# EAGLE schematic e4 (EAGLE 6.1)
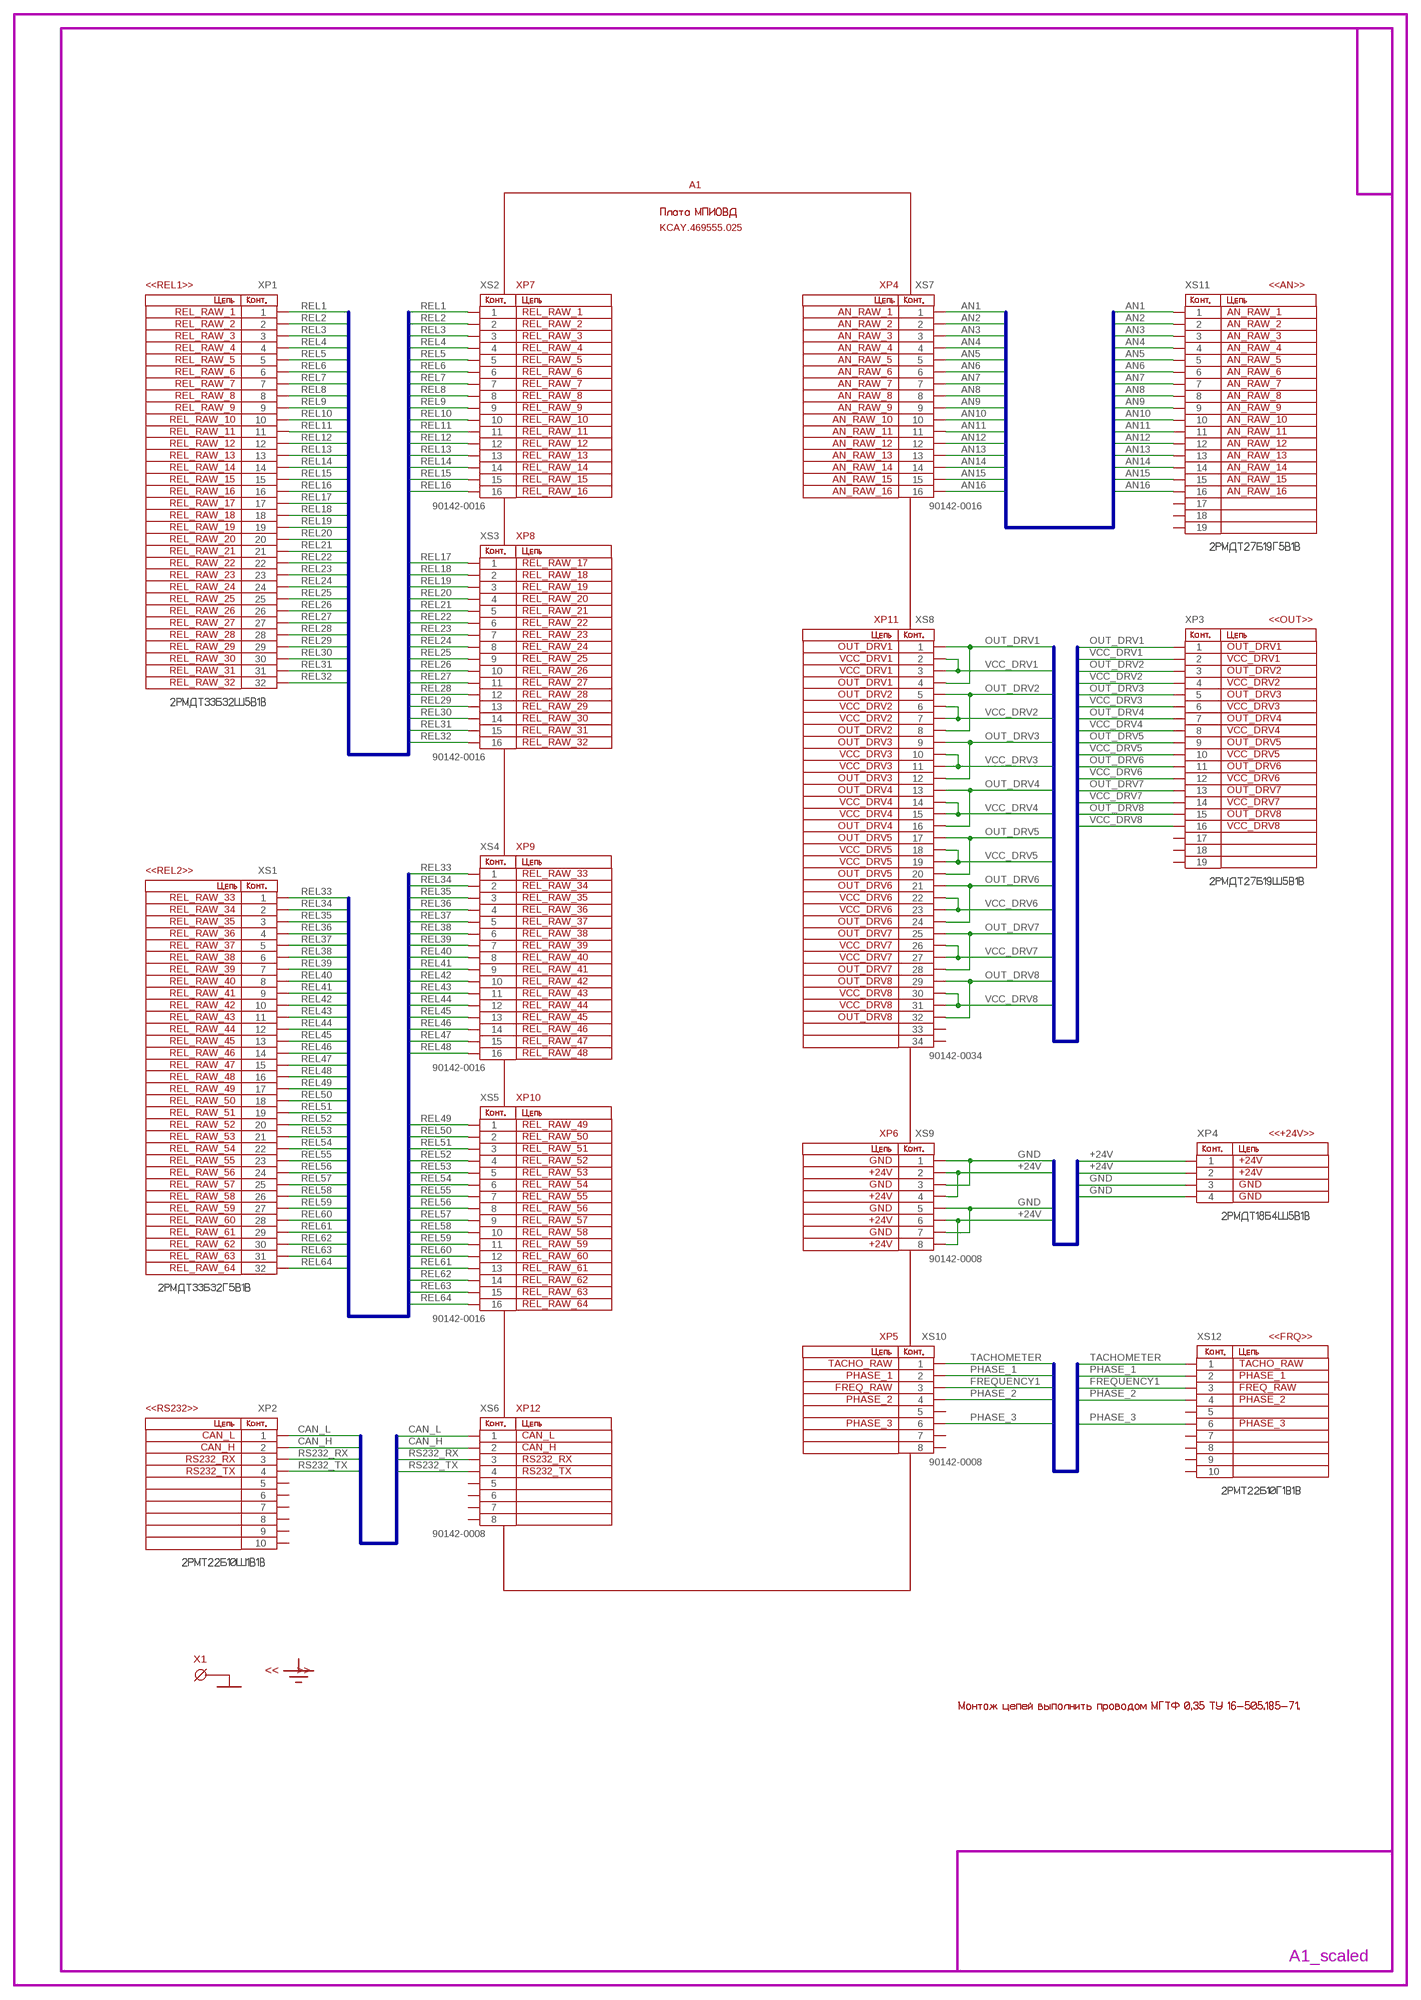
[diagram p0: schematic, sheet 1]

## Parts
XP1  GENERIC_32_XP  [FAKE]
XP2  GENERIC_10_XP  [FAKE]
XP3  GENERIC_19_XP  [FAKE]
XP4  GENERIC_04_XP  [FAKE]
XS1  GENERIC_32_XS  [FAKE]
XS2  90142-0016  GENERIC_16_XS  [FAKE]
XS3  90142-0016  GENERIC_16_XS  [FAKE]
XS4  90142-0016  GENERIC_16_XS  [FAKE]
XS5  90142-0016  GENERIC_16_XS  [FAKE]
XS6  90142-0008  GENERIC_08_XS  [FAKE]
XS7  90142-0016  GENERIC_16_XS  [FAKE]
XS8  90142-0034  GENERIC_34_XS  [FAKE]
XS9  90142-0008  GENERIC_08_XS  [FAKE]
XS10  90142-0008  GENERIC_08_XS  [FAKE]
XS11  GENERIC_19_XS  [FAKE]
XS12  GENERIC_10_XS  [FAKE]

## Nets
+24V: XP4.1 XP4.2 XS9.2 XS9.4 XS9.6 XS9.8
AN1: XS7.1 XS11.1
AN2: XS7.2 XS11.2
AN3: XS7.3 XS11.3
AN4: XS7.4 XS11.4
AN5: XS7.5 XS11.5
AN6: XS7.6 XS11.6
AN7: XS7.7 XS11.7
AN8: XS7.8 XS11.8
AN9: XS7.9 XS11.9
AN10: XS7.10 XS11.10
AN11: XS7.11 XS11.11
AN12: XS7.12 XS11.12
AN13: XS7.13 XS11.13
AN14: XS7.14 XS11.14
AN15: XS7.15 XS11.15
AN16: XS7.16 XS11.16
CAN_H: XP2.2 XS6.2
CAN_L: XP2.1 XS6.1
FREQUENCY1: XS10.3 XS12.3
GND: XP4.3 XP4.4 XS9.1 XS9.3 XS9.5 XS9.7
OUT_DRV1: XP3.1 XS8.1 XS8.4
OUT_DRV2: XP3.3 XS8.5 XS8.8
OUT_DRV3: XP3.5 XS8.9 XS8.12
OUT_DRV4: XP3.7 XS8.13 XS8.16
OUT_DRV5: XP3.9 XS8.17 XS8.20
OUT_DRV6: XP3.11 XS8.21 XS8.24
OUT_DRV7: XP3.13 XS8.25 XS8.28
OUT_DRV8: XP3.15 XS8.29 XS8.32
PHASE_1: XS10.2 XS12.2
PHASE_2: XS10.4 XS12.4
PHASE_3: XS10.6 XS12.6
REL1: XP1.1 XS2.1
REL2: XP1.2 XS2.2
REL3: XP1.3 XS2.3
REL4: XP1.4 XS2.4
REL5: XP1.5 XS2.5
REL6: XP1.6 XS2.6
REL7: XP1.7 XS2.7
REL8: XP1.8 XS2.8
REL9: XP1.9 XS2.9
REL10: XP1.10 XS2.10
REL11: XP1.11 XS2.11
REL12: XP1.12 XS2.12
REL13: XP1.13 XS2.13
REL14: XP1.14 XS2.14
REL15: XP1.15 XS2.15
REL16: XP1.16 XS2.16
REL17: XP1.17 XS3.1
REL18: XP1.18 XS3.2
REL19: XP1.19 XS3.3
REL20: XP1.20 XS3.4
REL21: XP1.21 XS3.5
REL22: XP1.22 XS3.6
REL23: XP1.23 XS3.7
REL24: XP1.24 XS3.8
REL25: XP1.25 XS3.9
REL26: XP1.26 XS3.10
REL27: XP1.27 XS3.11
REL28: XP1.28 XS3.12
REL29: XP1.29 XS3.13
REL30: XP1.30 XS3.14
REL31: XP1.31 XS3.15
REL32: XP1.32 XS3.16
REL33: XS1.1 XS4.1
REL34: XS1.2 XS4.2
REL35: XS1.3 XS4.3
REL36: XS1.4 XS4.4
REL37: XS1.5 XS4.5
REL38: XS1.6 XS4.6
REL39: XS1.7 XS4.7
REL40: XS1.8 XS4.8
REL41: XS1.9 XS4.9
REL42: XS1.10 XS4.10
REL43: XS1.11 XS4.11
REL44: XS1.12 XS4.12
REL45: XS1.13 XS4.13
REL46: XS1.14 XS4.14
REL47: XS1.15 XS4.15
REL48: XS1.16 XS4.16
REL49: XS1.17 XS5.1
REL50: XS1.18 XS5.2
REL51: XS1.19 XS5.3
REL52: XS1.20 XS5.4
REL53: XS1.21 XS5.5
REL54: XS1.22 XS5.6
REL55: XS1.23 XS5.7
REL56: XS1.24 XS5.8
REL57: XS1.25 XS5.9
REL58: XS1.26 XS5.10
REL59: XS1.27 XS5.11
REL60: XS1.28 XS5.12
REL61: XS1.29 XS5.13
REL62: XS1.30 XS5.14
REL63: XS1.31 XS5.15
REL64: XS1.32 XS5.16
RS232_RX: XP2.3 XS6.3
RS232_TX: XP2.4 XS6.4
TACHOMETER: XS10.1 XS12.1
VCC_DRV1: XP3.2 XS8.2 XS8.3
VCC_DRV2: XP3.4 XS8.6 XS8.7
VCC_DRV3: XP3.6 XS8.10 XS8.11
VCC_DRV4: XP3.8 XS8.14 XS8.15
VCC_DRV5: XP3.10 XS8.18 XS8.19
VCC_DRV6: XP3.12 XS8.22 XS8.23
VCC_DRV7: XP3.14 XS8.26 XS8.27
VCC_DRV8: XP3.16 XS8.30 XS8.31
Unconnected: XP2.5 XP2.6 XP2.7 XP2.8 XP2.9 XP2.10 XP3.17 XP3.18 XP3.19 XS6.5 XS6.6 XS6.7 XS6.8 XS8.33 XS8.34 XS10.5 XS10.7 XS10.8 XS11.17 XS11.18 XS11.19 XS12.5 XS12.7 XS12.8 XS12.9 XS12.10

## Buses
AN[1..16]
REL[1..64]
OUT_DRV[1..8],VCC_DRV[1..8]
+24,GND
PHASE1,PHASE2,PHASE3,TACHOMETER,FREQUENCY1
CAN_H,CAN_L,RS232_TX,RS232_RX

## Notes on the sheet
- A1
- KCAY.469555.025
- <<REL1>> | XP7 | XP4 | <<AN>>
- REL_RAW_1 | REL_RAW_1 | AN_RAW_1 | AN_RAW_1
- REL_RAW_2 | REL_RAW_2 | AN_RAW_2 | AN_RAW_2
- REL_RAW_3 | REL_RAW_3 | AN_RAW_3 | AN_RAW_3
- REL_RAW_4 | REL_RAW_4 | AN_RAW_4 | AN_RAW_4
- REL_RAW_5 | REL_RAW_5 | AN_RAW_5 | AN_RAW_5
- REL_RAW_6 | REL_RAW_6 | AN_RAW_6 | AN_RAW_6
- REL_RAW_7 | REL_RAW_7 | AN_RAW_7 | AN_RAW_7
- REL_RAW_8 | REL_RAW_8 | AN_RAW_8 | AN_RAW_8
- REL_RAW_9 | REL_RAW_9 | AN_RAW_9 | AN_RAW_9
- REL_RAW_10 | REL_RAW_10 | AN_RAW_10 | AN_RAW_10
- REL_RAW_11 | REL_RAW_11 | AN_RAW_11 | AN_RAW_11
- REL_RAW_12 | REL_RAW_12 | AN_RAW_12 | AN_RAW_12
- REL_RAW_13 | REL_RAW_13 | AN_RAW_13 | AN_RAW_13
- REL_RAW_14 | REL_RAW_14 | AN_RAW_14 | AN_RAW_14
- REL_RAW_15 | REL_RAW_15 | AN_RAW_15 | AN_RAW_15
- REL_RAW_16 | REL_RAW_16 | AN_RAW_16 | AN_RAW_16
- REL_RAW_17
- REL_RAW_18
- REL_RAW_19
- XP8
- REL_RAW_20
- REL_RAW_21
- REL_RAW_22 | REL_RAW_17
- REL_RAW_23 | REL_RAW_18
- REL_RAW_24 | REL_RAW_19
- REL_RAW_25 | REL_RAW_20
- REL_RAW_26 | REL_RAW_21
- XP11 | <<OUT>>
- REL_RAW_27 | REL_RAW_22
- REL_RAW_28 | REL_RAW_23
- REL_RAW_29 | REL_RAW_24 | OUT_DRV1 | OUT_DRV1
- REL_RAW_30 | REL_RAW_25 | VCC_DRV1 | VCC_DRV1
- REL_RAW_31 | REL_RAW_26 | VCC_DRV1 | OUT_DRV2
- REL_RAW_32 | REL_RAW_27 | OUT_DRV1 | VCC_DRV2
- REL_RAW_28 | OUT_DRV2 | OUT_DRV3
- REL_RAW_29 | VCC_DRV2 | VCC_DRV3
- REL_RAW_30 | VCC_DRV2 | OUT_DRV4
- REL_RAW_31 | OUT_DRV2 | VCC_DRV4
- REL_RAW_32 | OUT_DRV3 | OUT_DRV5
- VCC_DRV3 | VCC_DRV5
- VCC_DRV3 | OUT_DRV6
- OUT_DRV3 | VCC_DRV6
- OUT_DRV4 | OUT_DRV7
- VCC_DRV4 | VCC_DRV7
- VCC_DRV4 | OUT_DRV8
- OUT_DRV4 | VCC_DRV8
- OUT_DRV5
- XP9
- VCC_DRV5
- VCC_DRV5
- <<REL2>>
- REL_RAW_33 | OUT_DRV5
- REL_RAW_34 | OUT_DRV6
- REL_RAW_33 | REL_RAW_35 | VCC_DRV6
- REL_RAW_34 | REL_RAW_36 | VCC_DRV6
- REL_RAW_35 | REL_RAW_37 | OUT_DRV6
- REL_RAW_36 | REL_RAW_38 | OUT_DRV7
- REL_RAW_37 | REL_RAW_39 | VCC_DRV7
- REL_RAW_38 | REL_RAW_40 | VCC_DRV7
- REL_RAW_39 | REL_RAW_41 | OUT_DRV7
- REL_RAW_40 | REL_RAW_42 | OUT_DRV8
- REL_RAW_41 | REL_RAW_43 | VCC_DRV8
- REL_RAW_42 | REL_RAW_44 | VCC_DRV8
- REL_RAW_43 | REL_RAW_45 | OUT_DRV8
- REL_RAW_44 | REL_RAW_46
- REL_RAW_45 | REL_RAW_47
- REL_RAW_46 | REL_RAW_48
- REL_RAW_47
- REL_RAW_48
- REL_RAW_49
- XP10
- REL_RAW_50
- REL_RAW_51
- REL_RAW_52 | REL_RAW_49
- XP6 | <<+24V>>
- REL_RAW_53 | REL_RAW_50
- REL_RAW_54 | REL_RAW_51
- REL_RAW_55 | REL_RAW_52 | GND | +24V
- REL_RAW_56 | REL_RAW_53 | +24V | +24V
- REL_RAW_57 | REL_RAW_54 | GND | GND
- REL_RAW_58 | REL_RAW_55 | +24V | GND
- REL_RAW_59 | REL_RAW_56 | GND
- REL_RAW_60 | REL_RAW_57 | +24V
- REL_RAW_61 | REL_RAW_58 | GND
- REL_RAW_62 | REL_RAW_59 | +24V
- REL_RAW_63 | REL_RAW_60
- REL_RAW_64 | REL_RAW_61
- REL_RAW_62
- REL_RAW_63
- REL_RAW_64
- XP5 | <<FRQ>>
- TACHO_RAW | TACHO_RAW
- PHASE_1 | PHASE_1
- FREQ_RAW | FREQ_RAW
- PHASE_2 | PHASE_2
- <<RS232>> | XP12
- PHASE_3 | PHASE_3
- CAN_L | CAN_L
- CAN_H | CAN_H
- RS232_RX | RS232_RX
- RS232_TX | RS232_TX
- X1
- <<     >>

## Library data of the parts
XP1 = connector:GENERIC_32_XP
XP2 = connector:GENERIC_10_XP
XP3 = connector:GENERIC_19_XP
XP4 = connector:GENERIC_04_XP
XS1 = connector:GENERIC_32_XS
XS2-XS5 XS7 = connector:GENERIC_16_XS
XS6 XS9 XS10 = connector:GENERIC_08_XS
XS8 = connector:GENERIC_34_XS
XS11 = connector:GENERIC_19_XS
XS12 = connector:GENERIC_10_XS